# EAGLE design Decodificador de ppm (EAGLE 9.6.2)
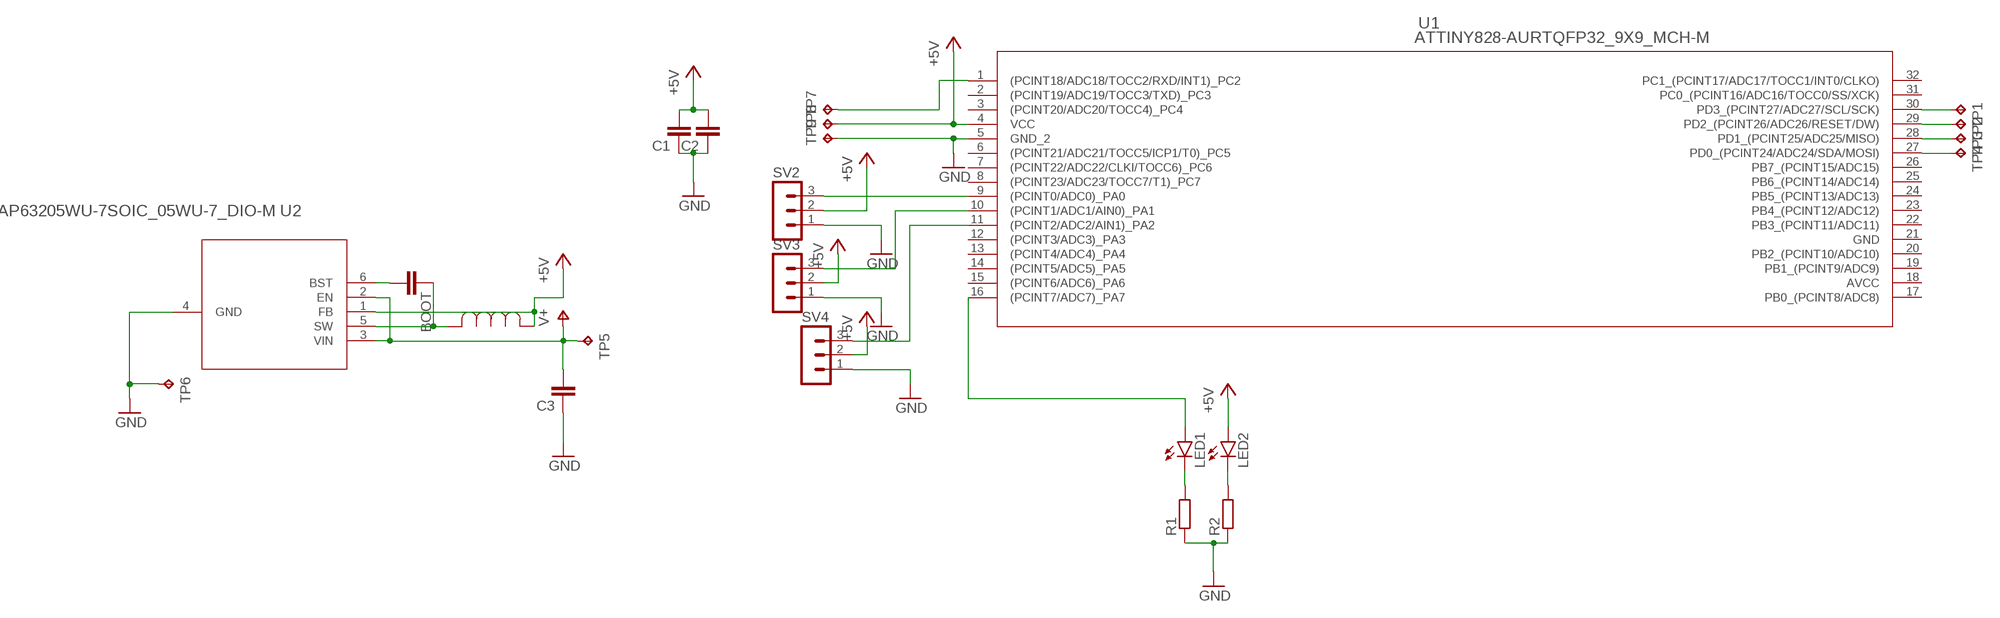
[diagram p0: schematic, sheet 1]

## Parts
BOOT  C-EUC0402  [C0402]
C1  C-EUC0805  [C0805]
C2  C-EUC0805  [C0805]
C3  C-EUC0805  [C0805]
LED1  LEDCHIP-LED0603  [CHIP-LED0603]
LED2  LEDCHIP-LED0603  [CHIP-LED0603]
R1  R-EU_R0805  [R0805]
R2  R-EU_R0805  [R0805]
SV2  MA03-1  [MA03-1]
SV3  MA03-1  [MA03-1]
SV4  MA03-1  [MA03-1]
TP1  TPB1,27  [B1,27]
TP2  TPB1,27  [B1,27]
TP3  TPB1,27  [B1,27]
TP4  TPB1,27  [B1,27]
TP5  TPTP19SQ  [TP19SQ]
TP6  TPTP19SQ  [TP19SQ]
TP7  TPTP19SQ  [TP19SQ]
TP8  TPTP19SQ  [TP19SQ]
TP9  TPTP19SQ  [TP19SQ]
U1  ATTINY828-AURTQFP32_9X9_MCH-M  [TQFP32_9X9_MCH-M]
U2  AP63205WU-7SOIC_05WU-7_DIO-M  [SOIC_05WU-7_DIO-M]
U$2  INDUCTOR4.7  [IND_NRS5030T100MMGJ_TAY]

## Nets
+5V: C1.2 C2.2 LED2.A SV2.2 SV3.2 SV4.2 TP8.TP U1.4(VCC) U2.1(FB) U$2.1
GND: C1.1 C2.1 C3.1 R1.1 R2.1 SV2.1 SV3.1 SV4.1 TP6.TP TP9.TP U1.5(GND_2) U2.4(GND)
N$1: LED1.C R1.2
N$2: LED2.C R2.2
N$3: TP7.TP U1.1((PCINT18/ADC18/TOCC2/RXD/INT1)_PC2)
N$4: TP1.TP U1.30(PD3_(PCINT27/ADC27/SCL/SCK))
N$5: TP2.TP U1.29(PD2_(PCINT26/ADC26/RESET/DW))
N$6: TP3.TP U1.28(PD1_(PCINT25/ADC25/MISO))
N$7: SV2.3 U1.9((PCINT0/ADC0)_PA0)
N$8: SV3.3 U1.10((PCINT1/ADC1/AIN0)_PA1)
N$9: SV4.3 U1.11((PCINT2/ADC2/AIN1)_PA2)
N$11: TP4.TP U1.27(PD0_(PCINT24/ADC24/SDA/MOSI))
N$13: LED1.A U1.16((PCINT7/ADC7)_PA7)
N$17: BOOT.1 U2.5(SW) U$2.2
N$18: BOOT.2 U2.6(BST)
V+: C3.2 TP5.TP U2.2(EN) U2.3(VIN)
Unconnected: U1.2((PCINT19/ADC19/TOCC3/TXD)_PC3) U1.3((PCINT20/ADC20/TOCC4)_PC4) U1.6((PCINT21/ADC21/TOCC5/ICP1/T0)_PC5) U1.7((PCINT22/ADC22/CLKI/TOCC6)_PC6) U1.8((PCINT23/ADC23/TOCC7/T1)_PC7) U1.12((PCINT3/ADC3)_PA3) U1.13((PCINT4/ADC4)_PA4) U1.14((PCINT5/ADC5)_PA5) U1.15((PCINT6/ADC6)_PA6) U1.17(PB0_(PCINT8/ADC8)) U1.18(AVCC) U1.19(PB1_(PCINT9/ADC9)) U1.20(PB2_(PCINT10/ADC10)) U1.21(GND) U1.22(PB3_(PCINT11/ADC11)) U1.23(PB4_(PCINT12/ADC12)) U1.24(PB5_(PCINT13/ADC13)) U1.25(PB6_(PCINT14/ADC14)) U1.26(PB7_(PCINT15/ADC15)) U1.31(PC0_(PCINT16/ADC16/TOCC0/SS/XCK)) U1.32(PC1_(PCINT17/ADC17/TOCC1/INT0/CLKO))

## Library data of the parts
BOOT C1-C3 = rcl:C-EU: CAPACITOR, European symbol; SPICEPREFIX: C
LED1 LED2 = led:LED: LED OSRAM: - CHIPLED LG R971, LG N971, LY N971, LG Q971, LY Q971, LO R971, LY R971 LH N974, LH R974 LS Q976, LO Q976, LY Q976 LO Q996 - Hyper CHIPLED LW Q18S LB Q993, LB Q99A, LB R99A - SideLED LS A670, LO A670, LY A670, LG A670, LP A670 LB A673, LV A673, LT A673, LW A673 LH A674 LY A675 LS A676, LA A676, LO A676, LY A676, LW A676 LS A679, LY A679, LG A679 - Hyper Micro SIDELED® LS Y876, LA Y876, LO Y876, LY Y876 LT Y87S - SmartLED LW L88C, LW L88S LB L89C, LB L89S, LG L890 LS L89K, LO L89K, LY L89K LS L896, LA L896, LO L896, LY L896 - TOPLED LS T670, LO T670, LY T670, LG T670, LP T670 LSG T670, LSP T670, LSY T670, LOP T670, LYG T670 LG T671, LOG T671, LSG T671 LB T673, LV T673, LT T673, LW T673 LH T674 LS T676, LA T676, LO T676, LY T676, LB T676, LH T676, LSB T676, LW T676 LB T67C, LV T67C, LT T67C, LS T67K, LO T67K, LY T67K, LW E67C LS E67B, LA E67B, LO E67B, LY E67B, LB E67C, LV E67C, LT E67C LW T67C LS T679, LY T679, LG T679 LS T770, LO T770, LY T770, LG T770, LP T770 LB T773, LV T773, LT T773, LW T773 LH T774 LS E675, LA E675, LY E675, LS T675 LS T776, LA T776, LO T776, LY T776, LB T776 LHGB T686 LT T68C, LB T68C - Hyper Mini TOPLED® LB M676 - Mini TOPLED Santana® LG M470 LS M47K, LO M47K, LY M47K Source: http://www.osram.convergy.de LUXEON: - LUMILED® LXK2-PW12-R00, LXK2-PW12-S00, LXK2-PW14-U00, LXK2-PW14-V00 LXK2-PM12-R00, LXK2-PM12-S00, LXK2-PM14-U00 LXK2-PE12-Q00, LXK2-PE12-R00, LXK2-PE12-S00, LXK2-PE14-T00, LXK2-PE14-U00 LXK2-PB12-K00, LXK2-PB12-L00, LXK2-PB12-M00, LXK2-PB14-N00, LXK2-PB14-P00, LXK2-PB14-Q00 LXK2-PR12-L00, LXK2-PR12-M00, LXK2-PR14-Q00, LXK2-PR14-R00 LXK2-PD12-Q00, LXK2-PD12-R00, LXK2-PD12-S00 LXK2-PH12-R00, LXK2-PH12-S00 LXK2-PL12-P00, LXK2-PL12-Q00, LXK2-PL12-R00 Source: www.luxeon.com KINGBRIGHT: KA-3528ASYC Source: www.kingbright.com
R1 R2 = rcl:R-EU_: RESISTOR, European symbol; SPICEPREFIX: R
SV2-SV4 = con-lstb:MA03-1: PIN HEADER; OC_FARNELL: unknown; OC_NEWARK: unknown
TP1-TP9 = testpad:TP: Test pad
U1 = Attiny828(secuencial:ATTINY828-AUR; BUILT_BY: EMA_Molly; COPYRIGHT: Copyright (C) 2018 Accelerated Designs. All rights reserved; MANUFACTURER_PART_NUMBER: ATTINY828-AUR; SOURCELIBRARY: Microchip_2019-08-23_25; VENDOR: Microchip
U2 = AP63205WU-7:AP63205WU-7; BUILT_BY: EMA_Matt; COPYRIGHT: Copyright (C) 2018 Accelerated Designs. All rights reserved; MANUFACTURER_PART_NUMBER: AP63205WU-7; SOURCELIBRARY: Diodes_Inc_2019-12-05; VENDOR: Diodes Inc
U$2 = Inductor4.7:INDUCTOR4.7

## Board
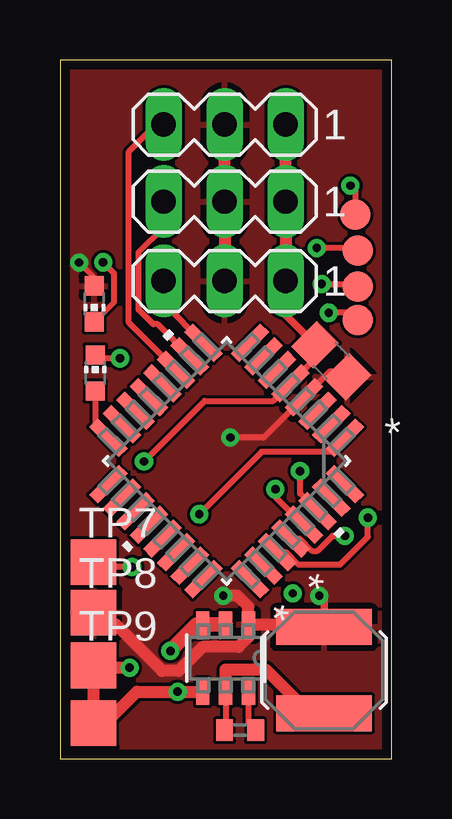
[diagram p1: board, top side]
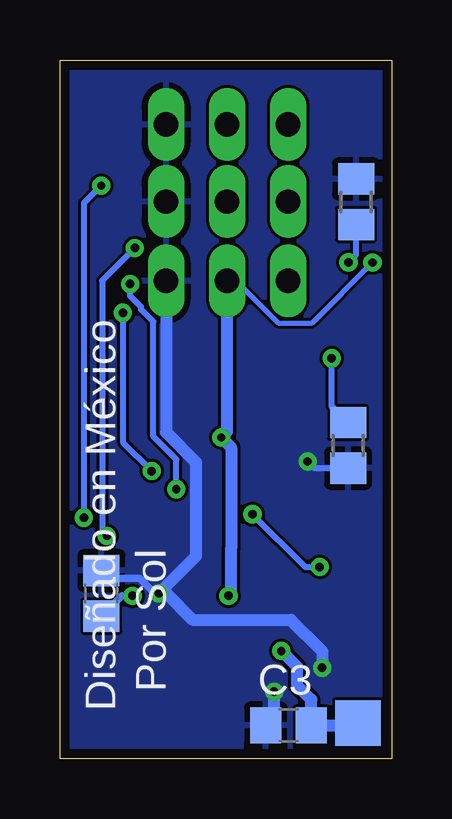
[diagram p2: board, bottom side, seen from below]

Size 13.82 x 29.14 mm. Coordinates in mm from the lower left corner, seen from the top.
Outline: 0,0 13.82,0 13.82,29.14 0,29.14 0,0
Copper layers (1*16): Top 0.035mm / dielectric 1.5mm / Bottom 0.035mm
Design rules "default *": minimum track width 6mil, minimum drill 0.35mm, track to track 5mil, track to pad 5mil, pad to pad 5mil, via to via 6mil, smd to smd 5mil, copper to edge 0.4mm, drill to drill 6mil, minimum pad ring 10mil, minimum via ring 8mil, stop-mask expansion 4mil, vias tented up to drill 0mil, thermal gap 10mil

### Footprints (pad centres in the part's own frame; a part is rotated, then mirrored left to right if it is on the bottom)
C0402 = smd 0.7 x 0.9: 1 -0.65,0; 2 0.65,0
C0805 = smd 1.3 x 1.5: 1 -0.95,0; 2 0.95,0
CHIP-LED0603 = smd 0.8 x 0.8: A 0,-0.75; C 0,0.75
R0805 = smd 1.3 x 1.5: 1 -0.95,0; 2 0.95,0
MA03-1 = drill 1.016 long: 1 -2.54,0; 2 0,0; 3 2.54,0
B1,27 = smd 1.27 x 1.27: TP 0,0
TP19SQ = smd 1.9 x 1.9: TP 0,0
TQFP32_9X9_MCH-M = smd 1.762 x 0.507: 1 -4.169,2.8; 2 -4.169,2; 3 -4.169,1.2; 4 -4.169,0.4; 5 -4.169,-0.4; 6 -4.169,-1.2; 7 -4.169,-2; 8 -4.169,-2.8; 17 4.169,-2.8; 18 4.169,-2; 19 4.169,-1.2; 20 4.169,-0.4; 21 4.169,0.4; 22 4.169,1.2; 23 4.169,2; 24 4.169,2.8 | smd 0.507 x 1.762: 9 -2.8,-4.169; 10 -2,-4.169; 11 -1.2,-4.169; 12 -0.4,-4.169; 13 0.4,-4.169; 14 1.2,-4.169; 15 2,-4.169; 16 2.8,-4.169; 25 2.8,4.169; 26 2,4.169; 27 1.2,4.169; 28 0.4,4.169; 29 -0.4,4.169; 30 -1.2,4.169; 31 -2,4.169; 32 -2.8,4.169
SOIC_05WU-7_DIO-M = smd 1.096 x 0.557: 1 -1.399,0.95; 2 -1.399,0; 3 -1.399,-0.95; 4 1.399,-0.95; 5 1.399,0; 6 1.399,0.95
IND_NRS5030T100MMGJ_TAY = smd 1.499 x 3.988: 1 -1.8,0; 2 1.8,0

### Placement (x,y rotation side)
BOOT  7.5,1.2 0 top
C1  11.3,16.6 315 top
C2  12.1,6.9 270 bottom
C3  4.3,1.4 0 bottom
LED1  1.47,16.09 0 top
LED2  1.43,18.97 180 top
R1  1.81,13.07 90 bottom
R2  1.48,23.23 270 bottom
SV2  6.86,19.93 180 top
SV3  6.86,23.24 180 top
SV4  6.86,26.45 180 top
TP1  12.4,18.3 0 top
TP2  12.4,19.7 0 top
TP3  12.4,21.2 0 top
TP4  12.3,22.7 0 top
TP5  1.4,1.5 0 bottom
TP6  1.4,1.5 0 top
TP7  1.4,8.2 0 top
TP8  1.4,6.1 0 top
TP9  1.4,3.9 0 top
U1  6.94,12.42 225 top
U2  6.9,4.2 270 top
U$2  11,3.7 270 top

### Tracks (layer width: path | path; a pad name or v marks a point on that pad's centre or on a via)
+5V  (via drill 0.35)
  Top 0.2: v0.8,20.69 1.43,20.06 LED2.A
  Top 0.254: C1.2 11.25,16.16 U1.4 8.49,13.4 v7.1,13.4 | U2.1 7.95,5.5 | U$2.1 11.8,5.5
  Top 0.305: v10.8,6.8 11,6.6 U$2.1
  Top 0.508: SV2.2 SV3.2 SV4.2 | U1.4 | U2.1 10.9,5.6 U$2.1 | U2.1 7.85,6.35 7.4,6.8 v6.8,6.8 | TP8.TP 1.9,5.6 2.32,5.6 4.25,3.67 4.95,3.67 5.95,4.67 7.44,4.67 7.85,5.08 U2.1
  Bottom 0.2: SV2.2 6.48,19.93 4.73,18.18 3.32,18.18 v0.8,20.69
  Bottom 0.305: v10.8,6.8 11.25,6.8 C2.2
  Bottom 0.508: v6.8,6.8 6.7,6.9 6.7,8.76 6.69,8.77 6.69,12.99 v7.1,13.4 6.86,13.64 SV2.2
  pour Top: 0,0 0,29 13.8,29 13.8,0
GND  (via drill 0.35)
  Top 0.254: C1.1 10.81,16.86 U1.5 8.88,14.93 6.03,14.93 v3.5,12.4
  Top 0.305: 1.44,1.54 TP6.TP | C1.1 9.4,18.5 SV2.1
  Top 0.508: SV2.1 SV3.1 SV4.1 | 1.65,1.5 TP6.TP | TP6.TP TP9.TP 1.5,3.8 v2.9,3.8 | TP6.TP 1.9,1.5 3.2,2.8 v4.9,2.8 U2.4
  Bottom 0.254: v3.5,12.4 3.22,12.12 R1.1
  Bottom 0.305: v9.7,6.9 9.87,6.9 10.5,7.53 11.78,7.53 C2.1
  Bottom 0.508: SV2.1 9.4,13.62 8.14,12.37 8.14,8.46 v9.7,6.9 9.4,6.9 8.3,5.8 4.2,5.8 2.9,4.5 v2.9,3.8 | C3.1 4.9,1.75 v4.9,2.8
  pour Bottom: 0,0 0,29 13.8,29 13.8,0
N$1  (via drill 0.35)
  Top 0.254: v2.5,16.7 1.61,16.7 LED1.C
  Bottom 0.254: R1.2 2.5,14.71 v2.5,16.7
N$2  (via drill 0.35)
  Top 0.2: LED2.C 2.26,19.05
  Top 0.254: 2.26,19.05 2.26,20.24 v1.8,20.7
  Bottom 0.254: v1.8,20.7 1.48,21.02 R2.2
N$3  (via drill 0.35)
  Top 0.254: U1.1 11.28,12.8 8.4,12.8 v5.8,10.2 | v3,8 1.6,8 TP7.TP
  Bottom 0.254: v5.8,10.2 3.6,8 v3,8
N$4  (via drill 0.35)
  Top 0.254: U1.30 10,11.06 v10,12 | TP1.TP 12.1,18.6 v11.2,18.6
  Bottom 0.254: v11.2,18.6 11.2,13.2 v10,12
N$5  (via drill 0.35)
  Top 0.254: U1.29 10.15,9.76 8.98,10.93 v8.98,11.24 | v10.9,19.8 12.3,19.8 TP2.TP
  Bottom 0.254: v8.98,11.24 8.98,12.48 9.93,13.44 9.93,18.23 10.44,18.73 10.44,18.84 10.9,19.3 v10.9,19.8
N$6  (via drill 0.35)
  Top 0.254: U1.28 9.98,9.19 10.5,8.67 10.73,8.67 11.36,9.3 v11.87,9.3 | TP3.TP 12.3,21.3 v10.7,21.3
  Bottom 0.254: v11.87,9.3 12.07,9.5 12.07,19.93 v10.7,21.3
N$7
  Top 0.254: U1.9 4.32,19 SV2.3
N$8
  Top 0.254: SV3.3 4.32,22.16 3.28,21.12 3.28,18.73 3.89,18.12 4.07,18.12 U1.10
N$9
  Top 0.254: SV4.3 3.91,26.36 2.87,25.32 2.87,18.19 U1.11
N$11  (via drill 0.35)
  Top 0.254: U1.27 9.42,8.62 9.93,8.11 11.67,8.11 12.83,9.26 v12.83,10.06 | v12.1,23.9 12.3,23.7 TP4.TP
  Bottom 0.254: v12.83,10.06 12.83,23.17 v12.1,23.9
N$13
  Top 0.254: LED1.A 1.47,13.93 U1.16
N$17
  Top 0.254: U2.5 6.9,1.25 BOOT.1
  Top 0.508: U2.5 6.9,3.73 8.57,3.73 10.4,1.9 U$2.2
N$18
  Top 0.254: BOOT.2 7.85,1.5 U2.6
V+  (via drill 0.35)
  Top 0.61: U2.2 U2.3 5.7,5.6 v4.6,4.5
  Bottom 0.508: TP5.TP 1.5,1.4 C3.2 3.35,2.47 3.93,3.06 3.93,3.83 v4.6,4.5

### Text on the board
bNames: Por Sol | Diseñado en México